# Altium schematic sheet BMS.SchDoc: BMS
size 420 x 297 mm; SheetNumber: 2
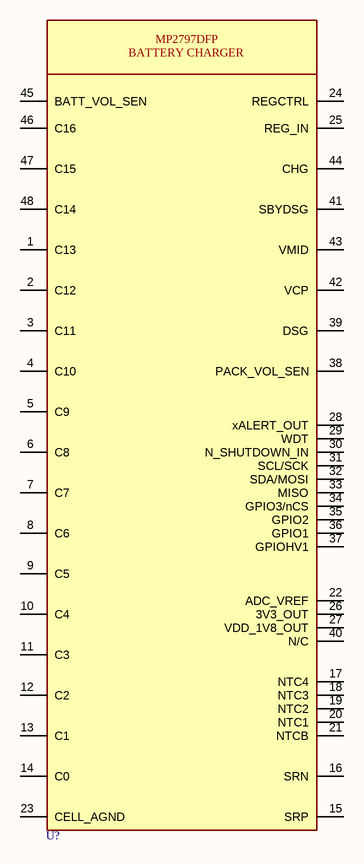
[diagram p0: BMS.SchDoc]

## Parts
U?  MP2797DFP  [MP2797DFP]  (value not drawn)

## Nets

Not connected (* = marked no-connect by the designer): U? 1(C13) 2(C12) 3(C11) 4(C10) 5(C9) 6(C8) 7(C7) 8(C6) 9(C5) 10(C4) 11(C3) 12(C2) 13(C1) 14(C0) 15(SRP) 16(SRN) 17(NTC4) 18(NTC3) 19(NTC2) 20(NTC1) 21(NTCB) 22(ADC_VREF) 23(CELL_AGND) 24(REGCTRL) 25(REG_IN) 26(3V3_OUT) 27(VDD_1V8_OUT) 28(xALERT_OUT) 29(WDT) 30(N_SHUTDOWN_IN) 31(SCL/SCK) 32(SDA/MOSI) 33(MISO) 34(GPIO3/nCS) 35(GPIO2) 36(GPIO1) 37(GPIOHV1) 38(PACK_VOL_SEN) 39(DSG) 40(N/C) 41(SBYDSG) 42(VCP) 43(VMID) 44(CHG) 45(BATT_VOL_SEN) 46(C16) 47(C15) 48(C14)

## Notes on the sheet
- PROJECT
- SIZE
- FILE NAME
- A3
- TITLE
- SHEET
- OF
- REV
- (in symbol MP2797DFP) BATTERY CHARGER

## Library data of the parts
U? = MP2797DFP: 7S - 16S, Battery Monitor and Protector with Coulomb Counting; Manufacturer 1: Monolithic Power Systems Inc.; Value: *; Manufacturer Part Number 1: *